# Altium schematic sheet POWER STAGE.SchDoc: POWER STAGE
size A3; DocumentNumber: 5; SheetNumber: 5; SheetTotal: 6
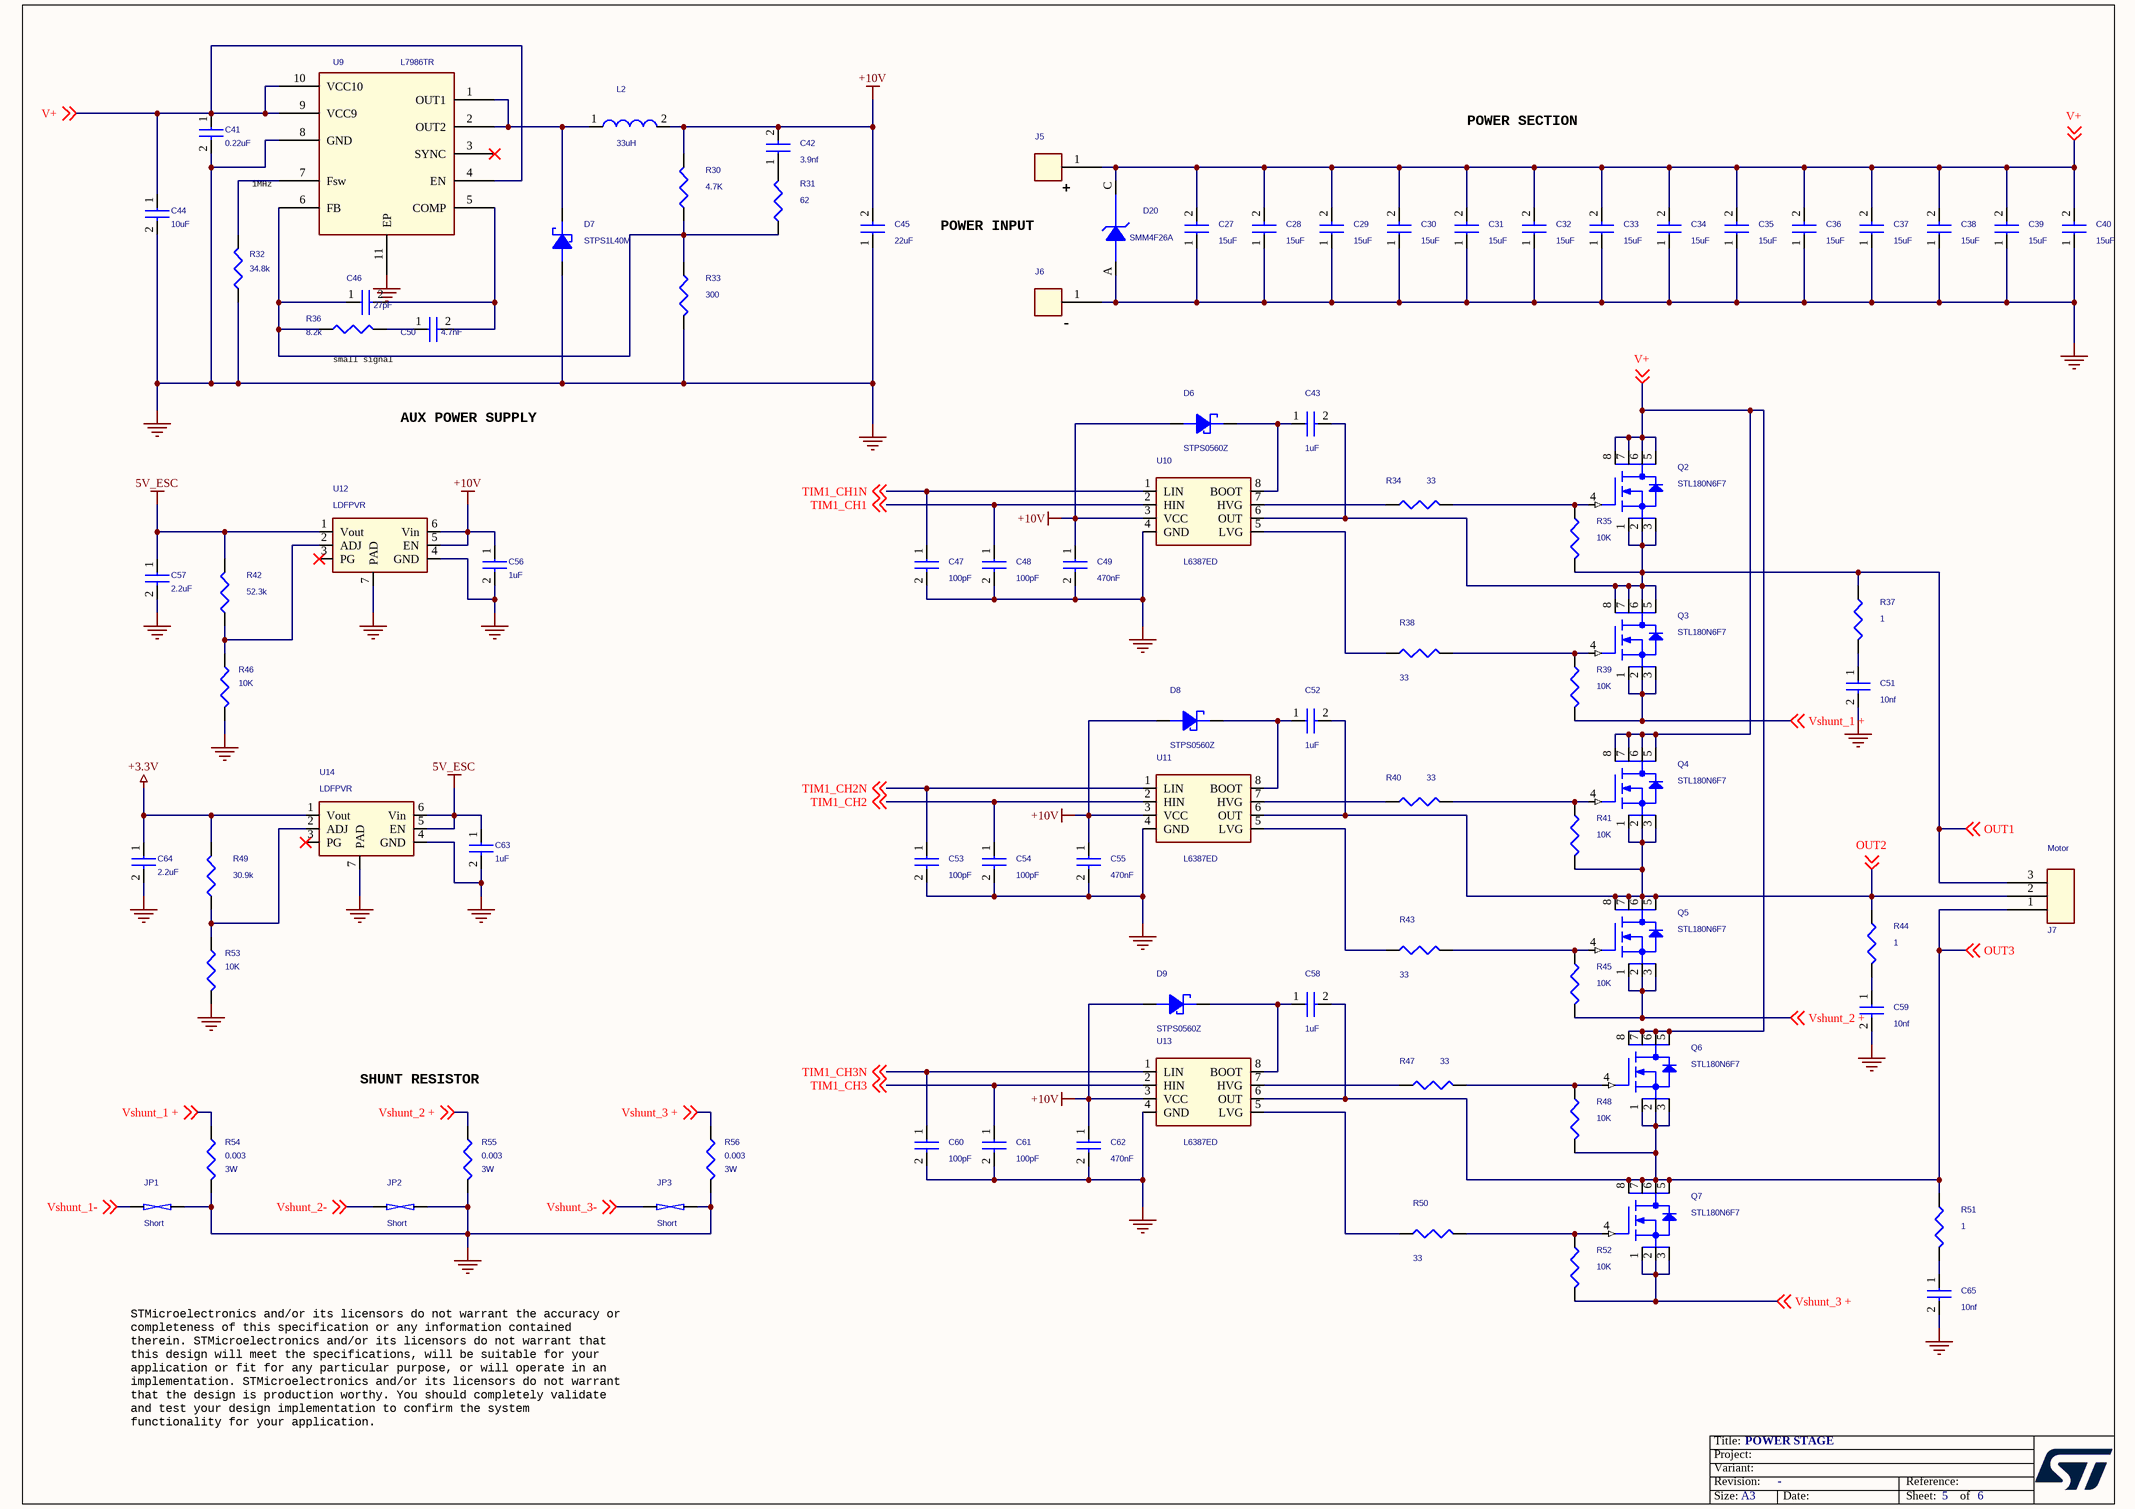
[diagram p0: POWER STAGE.SchDoc]

## Parts
C27  15uF  [C_0805_HD]
C28  15uF  [C_0805_HD]
C29  15uF  [C_0805_HD]
C30  15uF  [C_0805_HD]
C31  15uF  [C_0805_HD]
C32  15uF  [C_0805_HD]
C33  15uF  [C_0805_HD]
C34  15uF  [C_0805_HD]
C35  15uF  [C_0805_HD]
C36  15uF  [C_0805_HD]
C37  15uF  [C_0805_HD]
C38  15uF  [C_0805_HD]
C39  15uF  [C_0805_HD]
C40  15uF  [C_0805_HD]
C41  0.22uF  [C_0603_HD]
C42  3.9nf  [C_0402]
C43  1uF  [C_0603_HD]
C44  10uF  [C_1206]
C45  22uF  [C_1206]
C46  27pF  [C_0402]
C47  100pF  [C_0402]
C48  100pF  [C_0402]
C49  470nF  [C_0603_HD]
C50  4.7nF  [C_0402]
C51  10nf  [C_0603]
C52  1uF  [C_0603_HD]
C53  100pF  [C_0402]
C54  100pF  [C_0402]
C55  470nF  [C_0603_HD]
C56  1uF  [C_0402]
C57  2.2uF  [C_0402]
C58  1uF  [C_0603_HD]
C59  10nf  [C_0603]
C60  100pF  [C_0402]
C61  100pF  [C_0402]
C62  470nF  [C_0603_HD]
C63  1uF  [C_0402]
C64  2.2uF  [C_0402]
C65  10nf  [C_0603]
D6  STPS0560Z  [SOD_123]
D7  STPS1L40M  [do216-aa_stmite]
D8  STPS0560Z  [SOD_123]
D9  STPS0560Z  [SOD_123]
D20  SMM4F26A  [do216-aa-flat]
J5  CON1  [wire1_220s]  (value not drawn)
J6  CON1  [wire1_220s]  (value not drawn)
J7  Motor  [conn_motor_out]
JP1  Short  [SHORT]
JP2  Short  [SHORT]
JP3  Short  [SHORT]
L2  33uH  [ind_Coilcraft-LPS4018]
Q2  STL180N6F7  [power_flat_5x6]
Q3  STL180N6F7  [power_flat_5x6]
Q4  STL180N6F7  [power_flat_5x6]
Q5  STL180N6F7  [power_flat_5x6]
Q6  STL180N6F7  [power_flat_5x6]
Q7  STL180N6F7  [power_flat_5x6]
R30  4.7K  [R_0402]
R31  62  [R_0402]
R32  34.8k  [R_0402]
R33  300  [R_0402]
R34  33  [R_0603_HD]
R35  10K  [R_0402]
R36  8.2k  [R_0402]
R37  1  [R_0805]
R38  33  [R_0603_HD]
R39  10K  [R_0402]
R40  33  [R_0603_HD]
R41  10K  [R_0402]
R42  52.3k  [R_0402]
R43  33  [R_0603_HD]
R44  1  [R_0805]
R45  10K  [R_0402]
R46  10K  [R_0402]
R47  33  [R_0603_HD]
R48  10K  [R_0402]
R49  30.9k  [R_0402]
R50  33  [R_0603_HD]
R51  1  [R_0805]
R52  10K  [R_0402]
R53  10K  [R_0402]
R54  0.003  Rated Power: 3W  [resc635x300x60l193n]
R55  0.003  Rated Power: 3W  [resc635x300x60l193n]
R56  0.003  Rated Power: 3W  [resc635x300x60l193n]
U9  L7986TR  [son11p50_300x300x100l40x24t2-1]
U10  L6387ED  [SOIC8P127_490X600X175L83X42N]
U11  L6387ED  [SOIC8P127_490X600X175L83X42N]
U12  LDFPVR  [son7p65_200x200x100l25x30t18-1]
U13  L6387ED  [SOIC8P127_490X600X175L83X42N]
U14  LDFPVR  [son7p65_200x200x100l25x30t18-1]

## Nets
5V_ESC: C57.1 C63.1 R42.2 U12.1(Vout) U14.5(EN) U14.6(Vin)
+3.3V: C64.1 R49.2 U14.1(Vout)
+10V: C42.2 C45.2 C49.1 C55.1 C56.1 C62.1 D6.A D8.A D9.A L2.2 R30.1 U10.3(VCC) U11.3(VCC) U12.5(EN) U12.6(Vin) U13.3(VCC)
GND: C27.1 C28.1 C29.1 C30.1 C31.1 C32.1 C33.1 C34.1 C35.1 C36.1 C37.1 C38.1 C39.1 C40.1 C41.2 C44.2 C45.1 C47.2 C48.2 C49.2 C51.2 C53.2 C54.2 C55.2 C56.2 C57.2 C59.2 C60.2 C61.2 C62.2 C63.2 C64.2 C65.2 D7.A D20.A J6.1 JP1.2 JP2.2 JP3.2 R32.2 R33.1 R46.2 R53.2 R54.2 R55.2 R56.2 U9.8(GND) U9.11(EP) U10.4(GND) U11.4(GND) U12.4(GND) U12.7(PAD) U13.4(GND) U14.4(GND) U14.7(PAD)
OUT1: C43.2 J7.3 Q2.1(S1) Q2.2(S2) Q2.3(S3) Q3.5(D) Q3.6(D6) Q3.7(D7) Q3.8(D8) R35.2 R37.1 U10.6(OUT) ; off-sheet OUT1
OUT2: C52.2 J7.2 Q4.1(S1) Q4.2(S2) Q4.3(S3) Q5.5(D) Q5.6(D6) Q5.7(D7) Q5.8(D8) R41.2 R44.1 U11.6(OUT) ; off-sheet OUT2
OUT3: C58.2 J7.1 Q6.1(S1) Q6.2(S2) Q6.3(S3) Q7.5(D) Q7.6(D6) Q7.7(D7) Q7.8(D8) R48.2 R51.1 U13.6(OUT) ; off-sheet OUT3
TIM1_CH1: C48.1 U10.2(HIN) ; off-sheet TIM1_CH1
TIM1_CH1N: C47.1 U10.1(LIN) ; off-sheet TIM1_CH1N
TIM1_CH2: C54.1 U11.2(HIN) ; off-sheet TIM1_CH2
TIM1_CH2N: C53.1 U11.1(LIN) ; off-sheet TIM1_CH2N
TIM1_CH3: C61.1 U13.2(HIN) ; off-sheet TIM1_CH3
TIM1_CH3N: C60.1 U13.1(LIN) ; off-sheet TIM1_CH3N
V+: C27.2 C28.2 C29.2 C30.2 C31.2 C32.2 C33.2 C34.2 C35.2 C36.2 C37.2 C38.2 C39.2 C40.2 C41.1 C44.1 D20.C J5.1 Q2.5(D) Q2.6(D6) Q2.7(D7) Q2.8(D8) Q4.5(D) Q4.6(D6) Q4.7(D7) Q4.8(D8) Q6.5(D) Q6.6(D6) Q6.7(D7) Q6.8(D8) U9.4(EN) U9.9(VCC9) U9.10(VCC10) ; off-sheet V+
Vshunt_1 +: Q3.1(S1) Q3.2(S2) Q3.3(S3) R39.2 R54.1 ; off-sheet Vshunt_1 +
Vshunt_1-: JP1.1 ; off-sheet Vshunt_1-
Vshunt_2 +: Q5.1(S1) Q5.2(S2) Q5.3(S3) R45.2 R55.1 ; off-sheet Vshunt_2 +
Vshunt_2-: JP2.1 ; off-sheet Vshunt_2-
Vshunt_3 +: Q7.1(S1) Q7.2(S2) Q7.3(S3) R52.2 R56.1 ; off-sheet Vshunt_3 +
Vshunt_3-: JP3.1 ; off-sheet Vshunt_3-
NetC42_1: C42.1 R31.1
NetC43_1: C43.1 D6.C U10.8(BOOT)
NetC46_1: C46.1 R30.2 R31.2 R33.2 R36.2 U9.6(FB)
NetC46_2: C46.2 C50.2 U9.5(COMP)
NetC50_1: C50.1 R36.1
NetC51_1: C51.1 R37.2
NetC52_1: C52.1 D8.C U11.8(BOOT)
NetC58_1: C58.1 D9.C U13.8(BOOT)
NetC59_1: C59.1 R44.2
NetC65_1: C65.1 R51.2
NetD7_C: D7.C L2.1 U9.1(OUT1) U9.2(OUT2)
NetQ2_4: Q2.4(G) R34.2 R35.1
NetQ3_4: Q3.4(G) R38.2 R39.1
NetQ4_4: Q4.4(G) R40.2 R41.1
NetQ5_4: Q5.4(G) R43.2 R45.1
NetQ6_4: Q6.4(G) R47.2 R48.1
NetQ7_4: Q7.4(G) R50.2 R52.1
NetR32_1: R32.1 U9.7(Fsw)
NetR34_1: R34.1 U10.7(HVG)
NetR38_1: R38.1 U10.5(LVG)
NetR40_1: R40.1 U11.7(HVG)
NetR42_1: R42.1 R46.1 U12.2(ADJ)
NetR43_1: R43.1 U11.5(LVG)
NetR47_1: R47.1 U13.7(HVG)
NetR49_1: R49.1 R53.1 U14.2(ADJ)
NetR50_1: R50.1 U13.5(LVG)

Not connected (* = marked no-connect by the designer): U9 3(SYNC)*; U12 3(PG)*; U14 3(PG)*

## Notes on the sheet
- POWER SECTION
- 1MHz
- POWER INPUT
- (near J5) +
- (near R36) small signal
- (near J6) -
- AUX POWER SUPPLY
- (near R55) SHUNT RESISTOR
- STMicroelectronics and/or its licensors do not warrant the accuracy or
  completeness of this specification or any information contained
  therein. STMicroelectronics and/or its licensors do not warrant that
  this design will meet the specifications, will be suitable for your
  application or fit for any particular purpose, or will operate in an
  implementation. STMicroelectronics and/or its licensors do not warrant
  that the design is production worthy. You should completely validate
  and test your design implementation to confirm the system
  functionality for your application.
- Title:
- Project:
- Size:
- Revision:
- Variant:
- A3
- Date:
- Reference:
- Sheet:
- of

## Library data of the parts
C27-C40 = CAP_Dup1: CAP CER 15UF 35V X5R 0805; PART_NUMBER: TMP-773; Manufacturer: TDK Corporation; Manufacturer PN: C2012X5R1V156M125AC; Dielectric Type: Capacitors; Tolerance: 20%; CLASS: DISCRETE; ALT_SYMBOLS: C_0805_hd; Package Size: 0805 (2012 Metric); Temperature Coefficient: X5R; Rated Voltage: 35V
C41 = CAP_Dup1: CAP CER 0.22UF 50V X7R 0603; Manufacturer PN: CGA3E3X7R1H224K080AD; Manufacturer: TDK Corporation; PART_NUMBER: TMP-138; CLASS: DISCRETE; Tolerance: 10%; Dielectric Type: Capacitors; Rated Voltage: 50V; Temperature Coefficient: X7R; Package Size: 0603 (1608 Metric); ALT_SYMBOLS: c_0603_hd
C42 = CAP_Dup1: CAP CER 3900PF 16V X7R 0402; Manufacturer PN: C0402C392K4RAC7867; Manufacturer: KEMET; PART_NUMBER: TMP-419; CLASS: DISCRETE; Tolerance: 10%; Dielectric Type: Capacitors; Rated Voltage: 16V; Temperature Coefficient: X7R; Package Size: 0402 (1005 Metric)
C43 C52 C58 = CAP_Dup1: CAP CER 1UF 25V X7R 0603; PART_NUMBER: TMP-446; Manufacturer: Wurth Electronics Inc.; Manufacturer PN: 885012206076; Dielectric Type: Capacitors; Tolerance: 10%; CLASS: DISCRETE; ALT_SYMBOLS: c_0603_hd; Package Size: 0603 (1608 Metric); Temperature Coefficient: X7R; Rated Voltage: 25V
C44 = CAP_Dup1: CAP CER 10UF 50V X7R 1206; Manufacturer PN: CL31B106KBHNNNE; Manufacturer: Samsung Electro-Mechanics America, Inc.; PART_NUMBER: CAP-00000016; CLASS: DISCRETE; Tolerance: 10%; Dielectric Type: Capacitors; Rated Voltage: 50V; Temperature Coefficient: X7R; Package Size: 1206 (3216 Metric)
C45 = CAP_Dup1: CAP CER 22UF 25V X5R 1206; Manufacturer PN: GRT31CR61E226ME01L; Manufacturer: Murata Electronics North America; PART_NUMBER: TMP-421; CLASS: DISCRETE; Tolerance: 20%; Dielectric Type: Capacitors; Rated Voltage: 25V; Temperature Coefficient: X5R; Package Size: 1206 (3216 Metric)
C46 = CAP_Dup1: CAP CER 27PF 25V C0G/NP0 0402; Manufacturer PN: GRM1555C1E270JA01D; Manufacturer: Murata Electronics North America; PART_NUMBER: TMP-416; CLASS: DISCRETE; Tolerance: 5%; Temperature Coefficient: C0G, NP0; Dielectric Type: Capacitors; Rated Voltage: 25V; Package Size: 0402 (1005 Metric)
C47 C48 C53 C54 C60 C61 = CAP_Dup1: CAP CER 100PF 25V X7R 0402; PART_NUMBER: TMP-426; Manufacturer: Wurth Electronics Inc.; Manufacturer PN: 885012205038; Dielectric Type: Capacitors; Tolerance: 10%; CLASS: DISCRETE; Package Size: 0402 (1005 Metric); Temperature Coefficient: X7R; Rated Voltage: 25V
C49 C55 C62 = CAP_Dup1: CAP CER 0.47UF 25V X7R 0603; PART_NUMBER: TMP-428; Manufacturer: Wurth Electronics Inc.; Manufacturer PN: 885012206075; Dielectric Type: Capacitors; Tolerance: 10%; CLASS: DISCRETE; ALT_SYMBOLS: c_0603_hd; Package Size: 0603 (1608 Metric); Temperature Coefficient: X7R; Rated Voltage: 25V
C50 = CAP_Dup1: CAP CER 4700PF 16V X7R 0402; Manufacturer PN: 885012205029; Manufacturer: Wurth Electronics Inc.; PART_NUMBER: TMP-417; CLASS: DISCRETE; Tolerance: 10%; Dielectric Type: Capacitors; Rated Voltage: 16V; Temperature Coefficient: X7R; Package Size: 0402 (1005 Metric)
C51 C59 C65 = CAP_Dup1: CAP CER 10000PF 100V X7R 0603; PART_NUMBER: CAP-00000040; Manufacturer: TDK Corporation; Manufacturer PN: C1608X7R2A103M080AA; Dielectric Type: Capacitors; Tolerance: 20%; CLASS: DISCRETE; Package Size: 0603 (1608 Metric); Temperature Coefficient: X7R; Rated Voltage: 100V
C56 C63 = CAP_Dup1: CAP CER 1UF 25V X5R 0402; Manufacturer PN: GRM155R61E105KA12D; Manufacturer: Murata Electronics North America; PART_NUMBER: CAP-00000006; CLASS: DISCRETE; Tolerance: 10%; Dielectric Type: Capacitors; Rated Voltage: 25V; Temperature Coefficient: X5R; Package Size: 0402 (1005 Metric)
C57 C64 = CAP_Dup1: CAP CER 2.2UF 10V X5R 0402; PART_NUMBER: TMP-449; Manufacturer: Wurth Electronics Inc.; Manufacturer PN: 885012105013; Dielectric Type: Capacitors; Tolerance: 20%; CLASS: DISCRETE; Package Size: 0402 (1005 Metric); Temperature Coefficient: X5R; Rated Voltage: 10V
D6 D8 D9 = DIODE_SCHOTTKY_0: DIODE SCHOTTKY 60V 500MA SOD123; Manufacturer: STMicroelectronics; PART_NUMBER: TMP-373; CLASS: DISCRETE; Rated Voltage: 530mV @ 500mA; Manufacturer PN: STPS0560Z; Package Size: SOD-123
D7 = DIODE_SCHOTTKY_0: DIODE SCHOTTKY 40V 1A STMITE; PART_NUMBER: TMP-372; Manufacturer: STMicroelectronics; Rated Voltage: 460mV @ 1A; CLASS: DISCRETE; Package Size: DO-216AA; Manufacturer PN: STPS1L40M
D20 = DIODE_TRANSIL_UNI_0: TVS DIODE 26VWM 53.5VC DO222AA; Manufacturer PN: SMM4F26A-TR; Manufacturer: STMicroelectronics; PART_NUMBER: TMP-376; CLASS: DISCRETE; Package Size: DO-216AA FLAT
J5 J6 = CON1: SOLDER PADS
J7 = CON3: SOLDER PADS
JP1-JP3 = SHORT: 2 PIN SHORTED TO CONNECT DIFFERENT NETS; PART_NUMBER: TMP-442; CLASS: DISCRETE
L2 = IND: Fixed Inductors LPS4018 Low Profile 33uH 0.8A 20% SMD; Manufacturer PN: LPS4018-333MRB; Manufacturer: Coilcraft; PART_NUMBER: TMP-377; CLASS: DISCRETE; Tolerance: 20%; Package Size: 3.9x3.9x1.7
Q2-Q7 = MOSFET_N_DIODE_SSSGDDDD: N-channel 60 V, 1.9 mO typ., 120 A STripFET™ F7; PART_NUMBER: TMP-772; Manufacturer: STMicroelectronics; CLASS: DISCRETE; Rated Voltage: 60V; Package Size: PowerFLAT 5x6; Manufacturer PN: STL180N6F7
R30 = RES: RES SMD 4.7K OHM 1% 1/16W 0402; Manufacturer PN: CRG0402F4K7; Manufacturer: TE Connectivity Passive Product; PART_NUMBER: TMP-403; CLASS: DISCRETE; Rated Power: 0.063W, 1/16W; Temperature Coefficient: 100ppm/C; Tolerance: 1%; Package Size: 0402 (1005 Metric)
R31 = RES: RES SMD 62 OHM 1% 1/16W 0402; Manufacturer PN: RC0402FR-0762RL; Manufacturer: Yageo; PART_NUMBER: TMP-420; CLASS: DISCRETE; Rated Power: 0.063W, 1/16W; Temperature Coefficient: 100ppm/C; Tolerance: 1%; Package Size: 0402 (1005 Metric)
R32 = RES: RES SMD 34.8K OHM 1% 1/16W 0402; Manufacturer PN: RC0402FR-0734K8L; Manufacturer: Yageo; PART_NUMBER: TMP-415; CLASS: DISCRETE; Rated Power: 0.063W, 1/16W; Temperature Coefficient: 100ppm/C; Tolerance: 1%; Package Size: 0402 (1005 Metric)
R33 = RES: RES SMD 300 OHM 1% 1/16W 0402; PART_NUMBER: TMP-418; Manufacturer: Yageo; Manufacturer PN: RC0402FR-07300RL; Temperature Coefficient: 100ppm/C; Rated Power: 0.063W, 1/16W; CLASS: DISCRETE; Package Size: 0402 (1005 Metric); Tolerance: 1%
R34 R40 = RES: RES SMD 33 OHM 1% 1/10W 0603; Manufacturer PN: 9C06031A33R0FKHFT; Manufacturer: Yageo; PART_NUMBER: TMP-266; CLASS: DISCRETE; Rated Power: 0.1W, 1/10W; Temperature Coefficient: 100ppm/C; ALT_SYMBOLS: r_0603_hd; Tolerance: 1%; Package Size: 0603 (1608 Metric)
R35 R39 R41 R45 = RES: RES SMD 10K OHM 1% 1/16W 0402; Manufacturer PN: RC0402FR-0710KL; Manufacturer: Yageo; PART_NUMBER: TMP-396; CLASS: DISCRETE; Rated Power: 0.063W, 1/16W; Temperature Coefficient: 100ppm/C; Tolerance: 1%; Package Size: 0402 (1005 Metric)
R36 = RES: RES SMD 8.2K OHM 5% 1/16W 0402; Manufacturer PN: RC0402JR-078K2L; Manufacturer: Yageo; PART_NUMBER: RES-00000047; CLASS: DISCRETE; Rated Power: 0.063W, 1/16W; Temperature Coefficient: 100ppm/C; Tolerance: 5%; Package Size: 0402 (1005 Metric)
R37 R44 R51 = RES: RES SMD 1 OHM 5% 1/8W 0805; PART_NUMBER: TMP-430; Manufacturer: Panasonic Electronic Components; Manufacturer PN: ERJ-6GEYJ1R0V; Temperature Coefficient: -100/ +600ppm/C; Rated Power: 0.125W, 1/8W; CLASS: DISCRETE; Package Size: 0805 (2012 Metric); Tolerance: 5%
R38 R43 R47 R50 = RES: RES SMD 33 OHM 1% 1/10W 0603; PART_NUMBER: TMP-266; Manufacturer: Yageo; Manufacturer PN: 9C06031A33R0FKHFT; Temperature Coefficient: 100ppm/C; Rated Power: 0.1W, 1/10W; CLASS: DISCRETE; ALT_SYMBOLS: r_0603_hd; Package Size: 0603 (1608 Metric); Tolerance: 1%
R42 = RES: RES SMD 52.3K OHM 1% 1/16W 0402; Manufacturer PN: RC1005F5232CS; Manufacturer: Samsung Electro-Mechanics; PART_NUMBER: TMP-447; CLASS: DISCRETE; Rated Power: 0.063W, 1/16W; Temperature Coefficient: 100ppm/C; Tolerance: 1%; Package Size: 0402 (1005 Metric)
R46 = RES: RES SMD 10K OHM 1% 1/16W 0402; PART_NUMBER: TMP-396; Manufacturer: Yageo; Manufacturer PN: RC0402FR-0710KL; CLASS: DISCRETE; Rated Power: 0.063W, 1/16W; Temperature Coefficient: 100ppm/C; Package Size: 0402 (1005 Metric); Tolerance: 1%
R48 R52 R53 = RES: RES SMD 10K OHM 1% 1/16W 0402; PART_NUMBER: TMP-396; Manufacturer: Yageo; Manufacturer PN: RC0402FR-0710KL; Temperature Coefficient: 100ppm/C; Rated Power: 0.063W, 1/16W; CLASS: DISCRETE; Package Size: 0402 (1005 Metric); Tolerance: 1%
R49 = RES: RES SMD 30.9K OHM 1% 1/10W 0402; PART_NUMBER: TMP-448; Manufacturer: Panasonic Electronic Components; Manufacturer PN: ERJ-2RKF3092X; Temperature Coefficient: 100ppm/C; Rated Power: 0.1W, 1/10W; CLASS: DISCRETE; Package Size: 0402 (1005 Metric); Tolerance: 1%
R54 R56 = RES: RES 0.003 OHM 1% 3W 2512; PART_NUMBER: TMP-766; Manufacturer: TE Connectivity Passive Product; Manufacturer PN: TLR3A30DR003FTDG; Temperature Coefficient: 50ppm/C; CLASS: DISCRETE; Package Size: 2512 (6432 Metric); Tolerance: 1%
R55 = RES: RES 0.003 OHM 1% 3W 2512; Manufacturer PN: TLR3A30DR003FTDG; Manufacturer: TE Connectivity Passive Product; PART_NUMBER: TMP-766; CLASS: DISCRETE; Temperature Coefficient: 50ppm/C; Tolerance: 1%; Package Size: 2512 (6432 Metric)
U9 = L7986TR: IC REG BUCK ADJ 3A 10VDFPN; Manufacturer: STMicroelectronics; PART_NUMBER: TMP-362; Manufacturer PN: L7986TR; CLASS: IC; Package Size: 10-VFDFN Exposed Pad
U10 = L6387E: IC DRIVER HI/LO SIDE HV 8-SOIC; Manufacturer: STMicroelectronics; PART_NUMBER: TMP-367; Supply Voltage: 17V (Max); Manufacturer PN: L6387ED; CLASS: IC; Package Size: 8-SOIC (0.154", 3.90mm Width)
U11 U13 = L6387E: IC DRIVER HI/LO SIDE HV 8-SOIC; PART_NUMBER: TMP-367; Manufacturer: STMicroelectronics; Supply Voltage: 17V (Max); Package Size: 8-SOIC (0.154", 3.90mm Width); CLASS: IC; Manufacturer PN: L6387ED
U12 = LDFPxR: IC REG LINEAR POS ADJ 1A 6DFN; PART_NUMBER: TMP-450; Manufacturer: STMicroelectronics; Package Size: 6-VDFN Exposed Pad; CLASS: IC; Manufacturer PN: LDFPVR
U14 = LDFPxR: IC REG LINEAR POS ADJ 1A 6DFN; Manufacturer: STMicroelectronics; PART_NUMBER: TMP-450; Manufacturer PN: LDFPVR; CLASS: IC; Package Size: 6-VDFN Exposed Pad